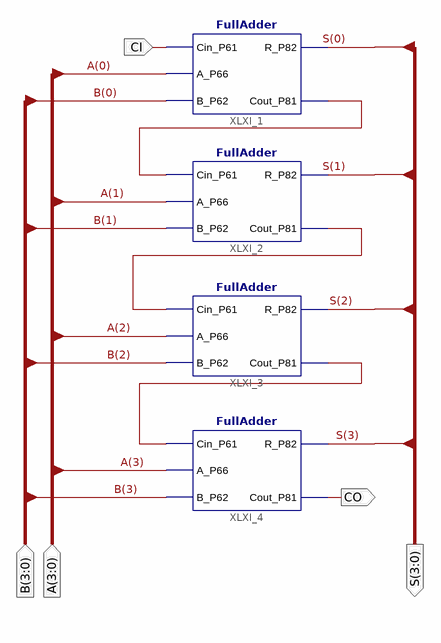
[diagram p0: schematic sheet 1]
// Xilinx ISE schematic FullAdder4Bit.sch (spartan6) as structural Verilog: 4 symbols, 5 ports
module FullAdder4Bit (
  input  [3:0] A,
  input  [3:0] B,
  input  CI,
  output [3:0] S,
  output CO
);

  wire XLXN_1, XLXN_2, XLXN_3;

  FullAdder XLXI_1 (.Cin_P61(CI), .A_P66(A[0]), .B_P62(B[0]), .R_P82(S[0]), .Cout_P81(XLXN_1));
  FullAdder XLXI_2 (.Cin_P61(XLXN_1), .A_P66(A[1]), .B_P62(B[1]), .R_P82(S[1]), .Cout_P81(XLXN_2));
  FullAdder XLXI_3 (.Cin_P61(XLXN_2), .A_P66(A[2]), .B_P62(B[2]), .R_P82(S[2]), .Cout_P81(XLXN_3));
  FullAdder XLXI_4 (.Cin_P61(XLXN_3), .A_P66(A[3]), .B_P62(B[3]), .R_P82(S[3]), .Cout_P81(CO));
endmodule
